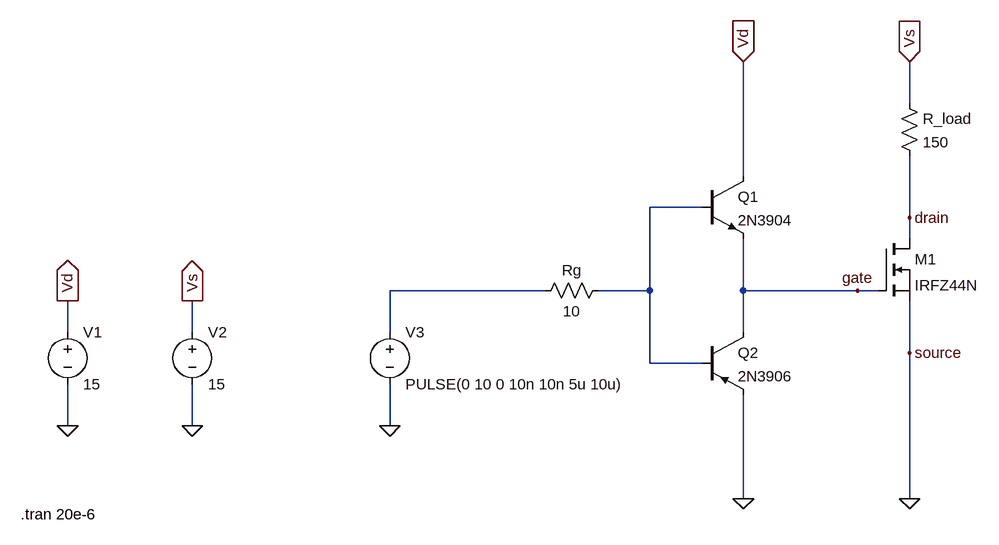
[diagram p0: schematic Totem Pole MOSFET.asc]
Totem Pole MOSFET.asc, the LTspice schematic file:
Version 4
SHEET 1 880 680
WIRE 496 -96 496 -160
WIRE 240 16 240 -160
WIRE 176 64 96 64
WIRE 496 80 496 -16
WIRE 496 112 496 80
WIRE -64 192 -304 192
WIRE 96 192 96 64
WIRE 96 192 16 192
WIRE 240 192 240 112
WIRE 416 192 240 192
WIRE 448 192 416 192
WIRE -800 256 -800 208
WIRE -608 256 -608 208
WIRE -304 256 -304 192
WIRE 240 256 240 192
WIRE 496 288 496 208
WIRE 96 304 96 192
WIRE 176 304 96 304
WIRE -800 400 -800 336
WIRE -608 400 -608 336
WIRE -304 400 -304 336
WIRE 240 512 240 352
WIRE 496 512 496 288
FLAG 496 512 0
FLAG 240 512 0
FLAG 240 -160 Vd
IOPIN 240 -160 In
FLAG 496 -160 Vs
IOPIN 496 -160 In
FLAG -800 400 0
FLAG -608 400 0
FLAG -800 208 Vd
IOPIN -800 208 Out
FLAG -608 208 Vs
IOPIN -608 208 Out
FLAG -304 400 0
FLAG 416 192 gate
FLAG 496 80 drain
FLAG 496 288 source
SYMBOL npn 176 16 R0
SYMATTR InstName Q1
SYMATTR Value 2N3904
SYMBOL pnp 176 256 R0
SYMATTR InstName Q2
SYMATTR Value 2N3906
SYMBOL res 32 176 R90
WINDOW 0 0 56 VBottom 2
WINDOW 3 32 56 VTop 2
SYMATTR InstName Rg
SYMATTR Value 10
SYMBOL nmos 448 112 R0
SYMATTR InstName M1
SYMATTR Value IRFZ44N
SYMBOL res 480 -112 R0
SYMATTR InstName R_load
SYMATTR Value 150
SYMBOL voltage -800 240 R0
WINDOW 123 0 0 Left 0
WINDOW 39 0 0 Left 0
SYMATTR InstName V1
SYMATTR Value 15
SYMBOL voltage -608 240 R0
WINDOW 123 0 0 Left 0
WINDOW 39 0 0 Left 0
SYMATTR InstName V2
SYMATTR Value 15
SYMBOL voltage -304 240 R0
WINDOW 123 0 0 Left 0
WINDOW 39 0 0 Left 0
SYMATTR InstName V3
SYMATTR Value PULSE(0 10 0 10n 10n 5u 10u)
TEXT -872 536 Left 2 !.tran 20e-6

The netlist it stands for:
* Totem Pole MOSFET.asc
Q1 Vd N001 gate 0 2N3904
Q2 gate N001 0 0 2N3906
Rg N001 N002 10
M1 drain gate 0 0 IRFZ44N
R_load Vs drain 150
V1 Vd 0 15
V2 Vs 0 15
V3 N002 0 PULSE(0 10 0 10n 10n 5u 10u)
.model NPN NPN
.model PNP PNP
.lib standard.bjt
.model NMOS NMOS
.model PMOS PMOS
.lib standard.mos
.tran 20e-6
.backanno
.end